# Altium schematic sheet Peripherals.SchDoc: main_assy PCB
size A4
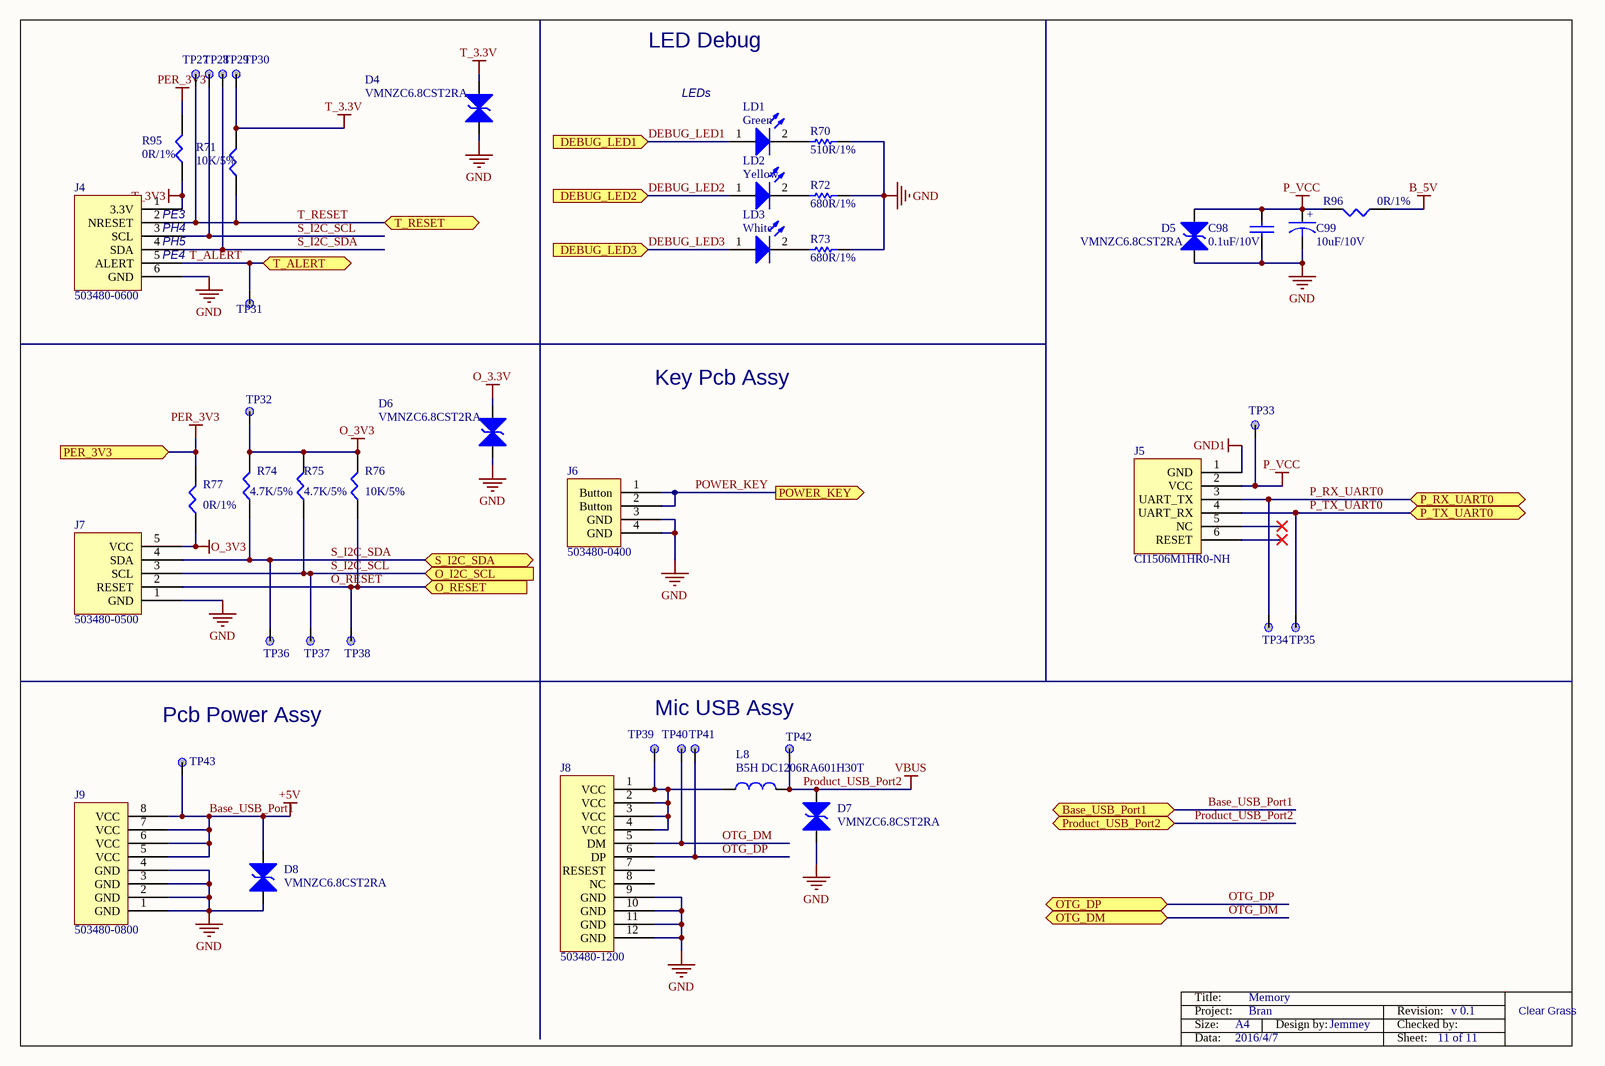
[diagram p0: Peripherals.SchDoc]

## Parts
C98  0.1uF/10V  [0402C]
C99  10uF/10V  [6032]
D4  VMNZC6.8CST2RA  [0402]
D5  VMNZC6.8CST2RA  [0402]
D6  VMNZC6.8CST2RA  [0402]
D7  VMNZC6.8CST2RA  [0402]
D8  VMNZC6.8CST2RA  [0402]
J4  503480-0600
J5  CI1506M1HR0-NH
J6  503480-0400
J7  503480-0500
J8  503480-1200
J9  503480-0800
L8  B5H DC1206RA601H30T  [1206]
LD1  Green  [0603D]
LD2  Yellow  [0603D]
LD3  White  [0603D]
R70  510R/1%  [0402R]
R71  10K/5%  [0402R]
R72  680R/1%  [0402R]
R73  680R/1%  [0402R]
R74  4.7K/5%  [0402R]
R75  4.7K/5%  [0402R]
R76  10K/5%  [0402R]
R77  0R/1%  [0402R]
R95  0R/1%  [0603R]
R96  0R/1%  [0603R]
TP27  TP  [TP_C40]  (value not drawn)
TP28  TP  [TP_C40]  (value not drawn)
TP29  TP  [TP_C40]  (value not drawn)
TP30  TP  [TP_C40]  (value not drawn)
TP31  TP  [TP_C40]  (value not drawn)
TP32  TP  [TP_C40]  (value not drawn)
TP33  TP  [TP_C40]  (value not drawn)
TP34  TP  [TP_C40]  (value not drawn)
TP35  TP  [TP_C40]  (value not drawn)
TP36  TP  [TP_C40]  (value not drawn)
TP37  TP  [TP_C40]  (value not drawn)
TP38  TP  [TP_C40]  (value not drawn)
TP39  TP  [TP_C40]  (value not drawn)
TP40  TP  [TP_C40]  (value not drawn)
TP41  TP  [TP_C40]  (value not drawn)
TP42  TP  [TP_C40]  (value not drawn)
TP43  TP  [TP_C40]  (value not drawn)

## Ports
Base_USB_Port1 (bidir), DEBUG_LED1 (in), DEBUG_LED2 (in), DEBUG_LED3 (in), O_I2C_SCL (in), O_RESET (in), OTG_DM (bidir), OTG_DP (bidir), P_RX_UART0 (bidir), P_TX_UART0 (bidir), PER_3V3 (in), POWER_KEY (out), Product_USB_Port2 (bidir), S_I2C_SDA (bidir), T_ALERT (bidir), T_RESET (bidir)

## Nets
B_5V: R96.1
Base_USB_Port1: D8.2(dIode2) J9.5(VCC) J9.6(VCC) J9.7(VCC) J9.8(VCC) TP43.1 ; port Base_USB_Port1  [also labelled +5V]
GND: C98.1 C99.2 D4.1(Diode1) D5.1(Diode1) D6.1(Diode1) D7.1(Diode1) D8.1(Diode1) J4.6(GND) J6.3(GND) J6.4(GND) J7.1(GND) J8.9(GND) J8.10(GND) J8.11(GND) J8.12(GND) J9.1(GND) J9.2(GND) J9.3(GND) J9.4(GND) R70.1 R72.1 R73.1
GND1: J5.1(GND)
O_3.3V: D6.2(dIode2)
O_3V3: J7.5(VCC) R74.2 R75.2 R76.2 R77.1 TP32.1
P_VCC: C98.2 C99.1 D5.2(dIode2) J5.2(VCC) R96.2 TP33.1
PER_3V3: R77.2 R95.2 ; port PER_3V3
Product_USB_Port2: D7.2(dIode2) L8.2 TP42.1 ; port Product_USB_Port2  [also labelled VBUS]
T_3.3V: D4.2(dIode2) R71.2 TP30.1
T_3V3: J4.1(3.3V) R95.1
DEBUG_LED1: LD1.1(A) ; port DEBUG_LED1
DEBUG_LED2: LD2.1(A) ; port DEBUG_LED2
DEBUG_LED3: LD3.1(A) ; port DEBUG_LED3
O_RESET: J7.2(RESET) R76.1 TP38.1 ; port O_RESET
OTG_DM: J8.5(DM) TP40.1 ; port OTG_DM
OTG_DP: J8.6(DP) TP41.1 ; port OTG_DP
P_RX_UART0: J5.3(UART_TX) TP34.1 ; port P_RX_UART0
P_TX_UART0: J5.4(UART_RX) TP35.1 ; port P_TX_UART0
POWER_KEY: J6.1(Button) J6.2(Button) ; port POWER_KEY
S_I2C_SCL: J4.3(SCL) J7.3(SCL) R75.1 TP28.1 TP37.1 ; port O_I2C_SCL
S_I2C_SDA: J4.4(SDA) J7.4(SDA) R74.1 TP29.1 TP36.1 ; port S_I2C_SDA
T_ALERT: J4.5(ALERT) TP31.1 ; port T_ALERT
T_RESET: J4.2(NRESET) R71.1 TP27.1 ; port T_RESET
NetJ8_1: J8.1(VCC) J8.2(VCC) J8.3(VCC) J8.4(VCC) L8.1 TP39.1
NetLD1_2: LD1.2(K) R70.2
NetLD2_2: LD2.2(K) R72.2
NetLD3_2: LD3.2(K) R73.2

Not connected (* = marked no-connect by the designer): J5 5(NC)* 6(RESET)*; J8 7(RESEST) 8(NC)

## Notes on the sheet
- LED Debug
- LEDs
- (near J4) PE4
- (near J4) PE3
- (near J4) PH4
- (near J4) PH5
- Key Pcb Assy
- (near TP43) Pcb Power Assy
- Mic USB Assy
- Title:
- Memory
- Project:
- Size:
- Data:
- A4
- 2016/4/7
- Bran
- Design by:
- Jemmey
- Revision:
- Sheet:
- Checked by:
- 11 of 11
- v 0.1
- Clear Grass
- (in symbol Capacitor) +

## Library data of the parts
C98 = CAP: 厂家：Murata，型号：GRM155R71A104KA01D
C99 = Capacitor
D4-D8 = ESD_1: 厂家：ROHM，型号：VMNZC6.8CST2RA
J4 = 50348: 厂家：Molex，型号：503480-0600
J5 = CI1506M1HR0-NH: 厂家：瀚荃股份，型号：CI1506M1HR0-NH
J6 = 50348: 厂家：Molex，型号：503480-0400
J7 = 50348: 厂家：Molex，型号：503480-0500
J8 = 50348: 厂家：Molex，型号：503480-1200
J9 = 50348: 厂家：Molex，型号：503480-0800
L8 = CHOKE: 厂家：宇磁，型号：B5H DC1206RA601H30T
LD1-LD3 = LED2: Typical RED, GREEN, YELLOW, AMBER GaAs LED; Ordered by: Subcon; ECCN_US/EU: EAR99/NEC; Published: 8-Jun-2000; Revision: July-2002: Re-released for DXP Platform.; Publisher: Altium Limited
R70 R72 R73 = Res1: Resistor; Value: 1K; Ordered by: Subcon; Published: 8-Jun-2000; Revision: July-2002: Re-released for DXP Platform.; Publisher: Altium Limited
R71 R74 R75 R77 = RES1: 厂家：Yageo，型号：
R76 = RES1: 厂家：Yageo，型号：RC0402FR-0710KL
R95 R96 = RES1: 厂家：Yageo，型号：RC0402FR-070RL
TP27-TP43 = TP: Ordered by: Subcon